# EAGLE design USBMICRO-10118193-0001LF_breakout (EAGLE 7.3.0)
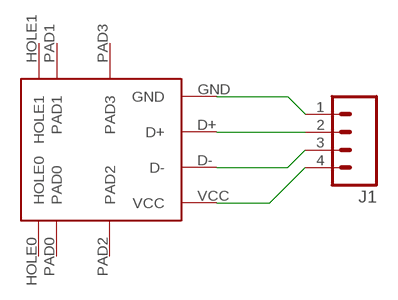
[diagram p0: schematic, sheet 1]

## Parts
J1  M04PTH  [1X04]
U$1  USBMICRO-10118193-0001LF  [USBMICRO-10118193-0001LF]

## Nets
N$1: J1.1 U$1.GND
N$2: J1.2 U$1.D+
N$3: J1.3 U$1.D-
N$4: J1.4 U$1.VCC
Unconnected: U$1.HOLE0 U$1.HOLE1 U$1.PAD0 U$1.PAD1 U$1.PAD2 U$1.PAD3

## Library data of the parts
J1 = SparkFun-Connectors:M04: Header 4 Standard 4-pin 0.1" header. Use with straight break away headers (SKU : PRT-00116), right angle break away headers (PRT-00553), swiss pins (PRT-00743), machine pins (PRT-00117), and female headers (PRT-00115). Molex polarized connector foot print use with SKU : PRT-08231 with associated crimp pins and housings. 1MM SMD Version SKU: PRT-10208; PROD_ID: CONN-09696
U$1 = awqua_eagle_library:USBMICRO-10118193-0001LF

## Board
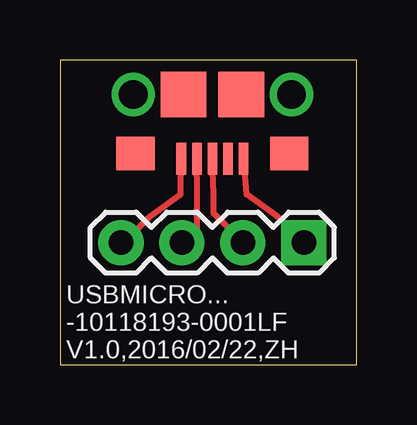
[diagram p1: board, top side]

Size 12.37 x 12.69 mm. Coordinates in mm from the lower left corner, seen from the top.
Outline: 0,0 12.37,0 12.37,12.69 0,12.69 0,0
Copper layers (1*16): Top 0.035mm / dielectric 1.5mm / Bottom 0.035mm
Design rules "default": minimum track width 10mil, minimum drill 24mil, track to track 8mil, track to pad 8mil, pad to pad 8mil, via to via 8mil, smd to smd 8mil, copper to edge 40mil, drill to drill 8mil, minimum pad ring 10mil, minimum via ring 8mil, stop-mask expansion 4mil, vias tented up to drill 0mil, thermal gap 10mil

### Footprints (pad centres in the part's own frame; a part is rotated, then mirrored left to right if it is on the bottom)
1X04 = drill 1.016 pad 1.88 square: 1 0,0 | drill 1.016 pad 1.88: 2 2.54,0; 3 5.08,0; 4 7.62,0
USBMICRO-10118193-0001LF = smd 0.4 x 1.35: D+ 0,4.125; D- 0.65,4.125; DNP -0.65,4.125; GND -1.3,4.125; VCC 1.3,4.125 | drill 1.2 pad 1.6: HOLE0 3.3,1.45; HOLE1 -3.3,1.45 | smd 1.9 x 1.9: PAD0 1.2,1.45; PAD1 -1.2,1.45 | smd 1.6 x 1.4: PAD2 3.2,3.9; PAD3 -3.2,3.9

### Placement (x,y rotation side)
J1  10.16,5.08 180 top
U$1  6.35,12.7 180 top

### Tracks (layer width: path | path; a pad name or v marks a point on that pad's centre or on a via)
N$1
  Top 0.254: U$1.GND 7.77,7.09 9.04,6.17 10.06,5.16 J1.1
N$2
  Top 0.254: J1.2 6.4,6.3 6.4,7.09 U$1.D+
N$3
  Top 0.254: U$1.D- 5.71,7.09 5.71,5.61 5.26,5.16 J1.3
N$4
  Top 0.254: U$1.VCC 5.03,7.09 3.76,6.17 2.74,5.16 J1.4

### Text on the board
tPlace: USBMICRO... / -10118193-0001LF / V1.0,2016/02/22,ZH